# EAGLE schematic lipolski-control (EAGLE 7.7.0)
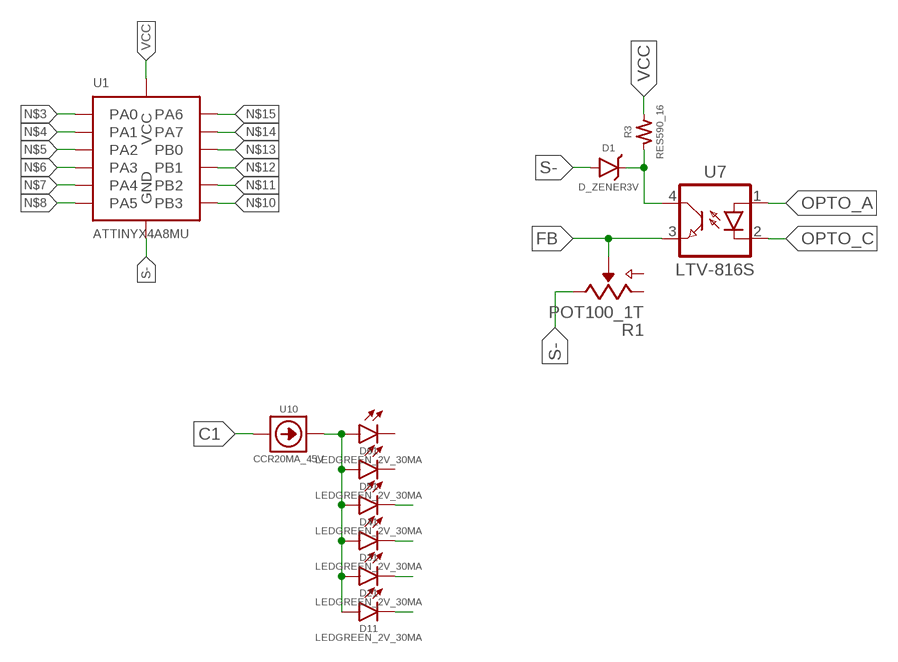
[diagram p0: schematic, sheet 1]

## Parts
D1  D_ZENER3V  [SOT23-3]
D11  LEDGREEN_2V_30MA  [0603+]
D21  LEDGREEN_2V_30MA  [0603+]
D31  LEDGREEN_2V_30MA  [0603+]
D41  LEDGREEN_2V_30MA  [0603+]
D51  LEDGREEN_2V_30MA  [0603+]
D61  LEDGREEN_2V_30MA  [0603+]
R1  POT100_1T  [ST-4EA]
R3  RES590_16  [0402]
U1  ATTINYX4A8MU  [ATTINYX4A]
U7  LTV-816S  [4-OPTO-1]
U10  CCR20MA_45V  [SOD-123]

## Nets
C1: U10.A
FB: R1.2(S) U7.3(E)
N$1: D1.3(C) R3.1 U7.4(C)
N$2: D11.A D21.A D31.A D41.A D51.A D61.A U10.C
N$3: U1.5(PA0)
N$4: U1.4(PA1)
N$5: U1.3(PA2)
N$6: U1.2(PA3)
N$7: U1.1(PA4)
N$8: U1.20(PA5)
N$9: D31.C
N$10: U1.13(PB3)
N$11: U1.14(PB2)
N$12: U1.12(PB1)
N$13: U1.11(PB0)
N$14: U1.15(PA7)
N$15: U1.16(PA6)
N$16: D21.C
N$17: D11.C
N$18: D41.C
OPTO_A: U7.1(A)
OPTO_C: U7.2(K)
S-: D1.1(A) R1.3(E) U1.8(GND) U1.PAD(GND)
VCC: R3.2 U1.9(VCC)
Unconnected: D51.C D61.C R1.1(A)

## Library data of the parts
D1 = dubec:D_ZENER: Zener diode; DIGIKEY_PART_#: BZX84B3V0-FDICT-ND; EURO: 34.78/1000; IR: 10µA @ 1V; MANUFACTURER: Diodes Incorporated; MFG_PART_#: BZX84B3V0-7-F; TOLERANCE: ±2%; ZZT: 95 Ohm
D11 D21 D31 D41 D51 D61 = dubec:LED: LED; DIGIKEY_PART_#: 160-1435-1-ND; EURO: 3.26/25; LUM: 35mcd; MANUFACTURER: Lite-On Inc.; MFG_PART_#: LTST-C190KGKT
R1 = dubec:POT: Trimmer; DIGIKEY_PART_#: ST4ETA101CT-ND; EURO: 588.71/1000; MANUFACTURER: Copal Electronics Inc.; MFG_PART_#: ST4ETA101; POWER: 1/4W; TEMP: ±100ppm/°C; TOLERANCE: ±20%
R3 = dubec:RES: Resistor; DIGIKEY_PART_#: 541-590LCT-ND; EURO: 2.27/50; MANUFACTURER: Vishay Dale; MFG_PART_#: CRCW0402590RFKED; TEMP: ±100ppm/°C; TOLERANCE: ±1%
U1 = dubec:ATTINYX4A: Atmel AVR® ATtiny Microcontroller IC 8-Bit 20MHz 8KB (4K x 16); ADC: 8x10b; DIGIKEY_PART_#: ATTINY84A-MU-ND; EURO: 637.90/1000; FLASH: 8KB (4K x 16); FREQ: 20MHz; MANUFACTURER: Atmel; MFG_PART_#: ATTINY84A-MU; RAM: 512 x 8; TEMP: -40°C ~ 85°C (TA); VCC: 1.8 V ~ 5.5 V
U7 = dubec:LTV-8; DIGIKEY_PART_#: 160-1361-5-ND; EURO: 5.67/25; I_FWD: 50mA; MANUFACTURER: Lite-On Inc.; MFG_PART_#: LTV-816S; TEMP: -50°C ~ 110°C
U10 = dubec:CCR; DIGIKEY_PART_#: NSI45020T1GOSCT-ND; EURO: 3.36/10; MANUFACTURER: ON Semiconductor; MFG_PART_#: NSI45020T1G; TOLERANCE: ±15%